# EAGLE design TSOC-USBUART1-3-2 (EAGLE 6.6.0)
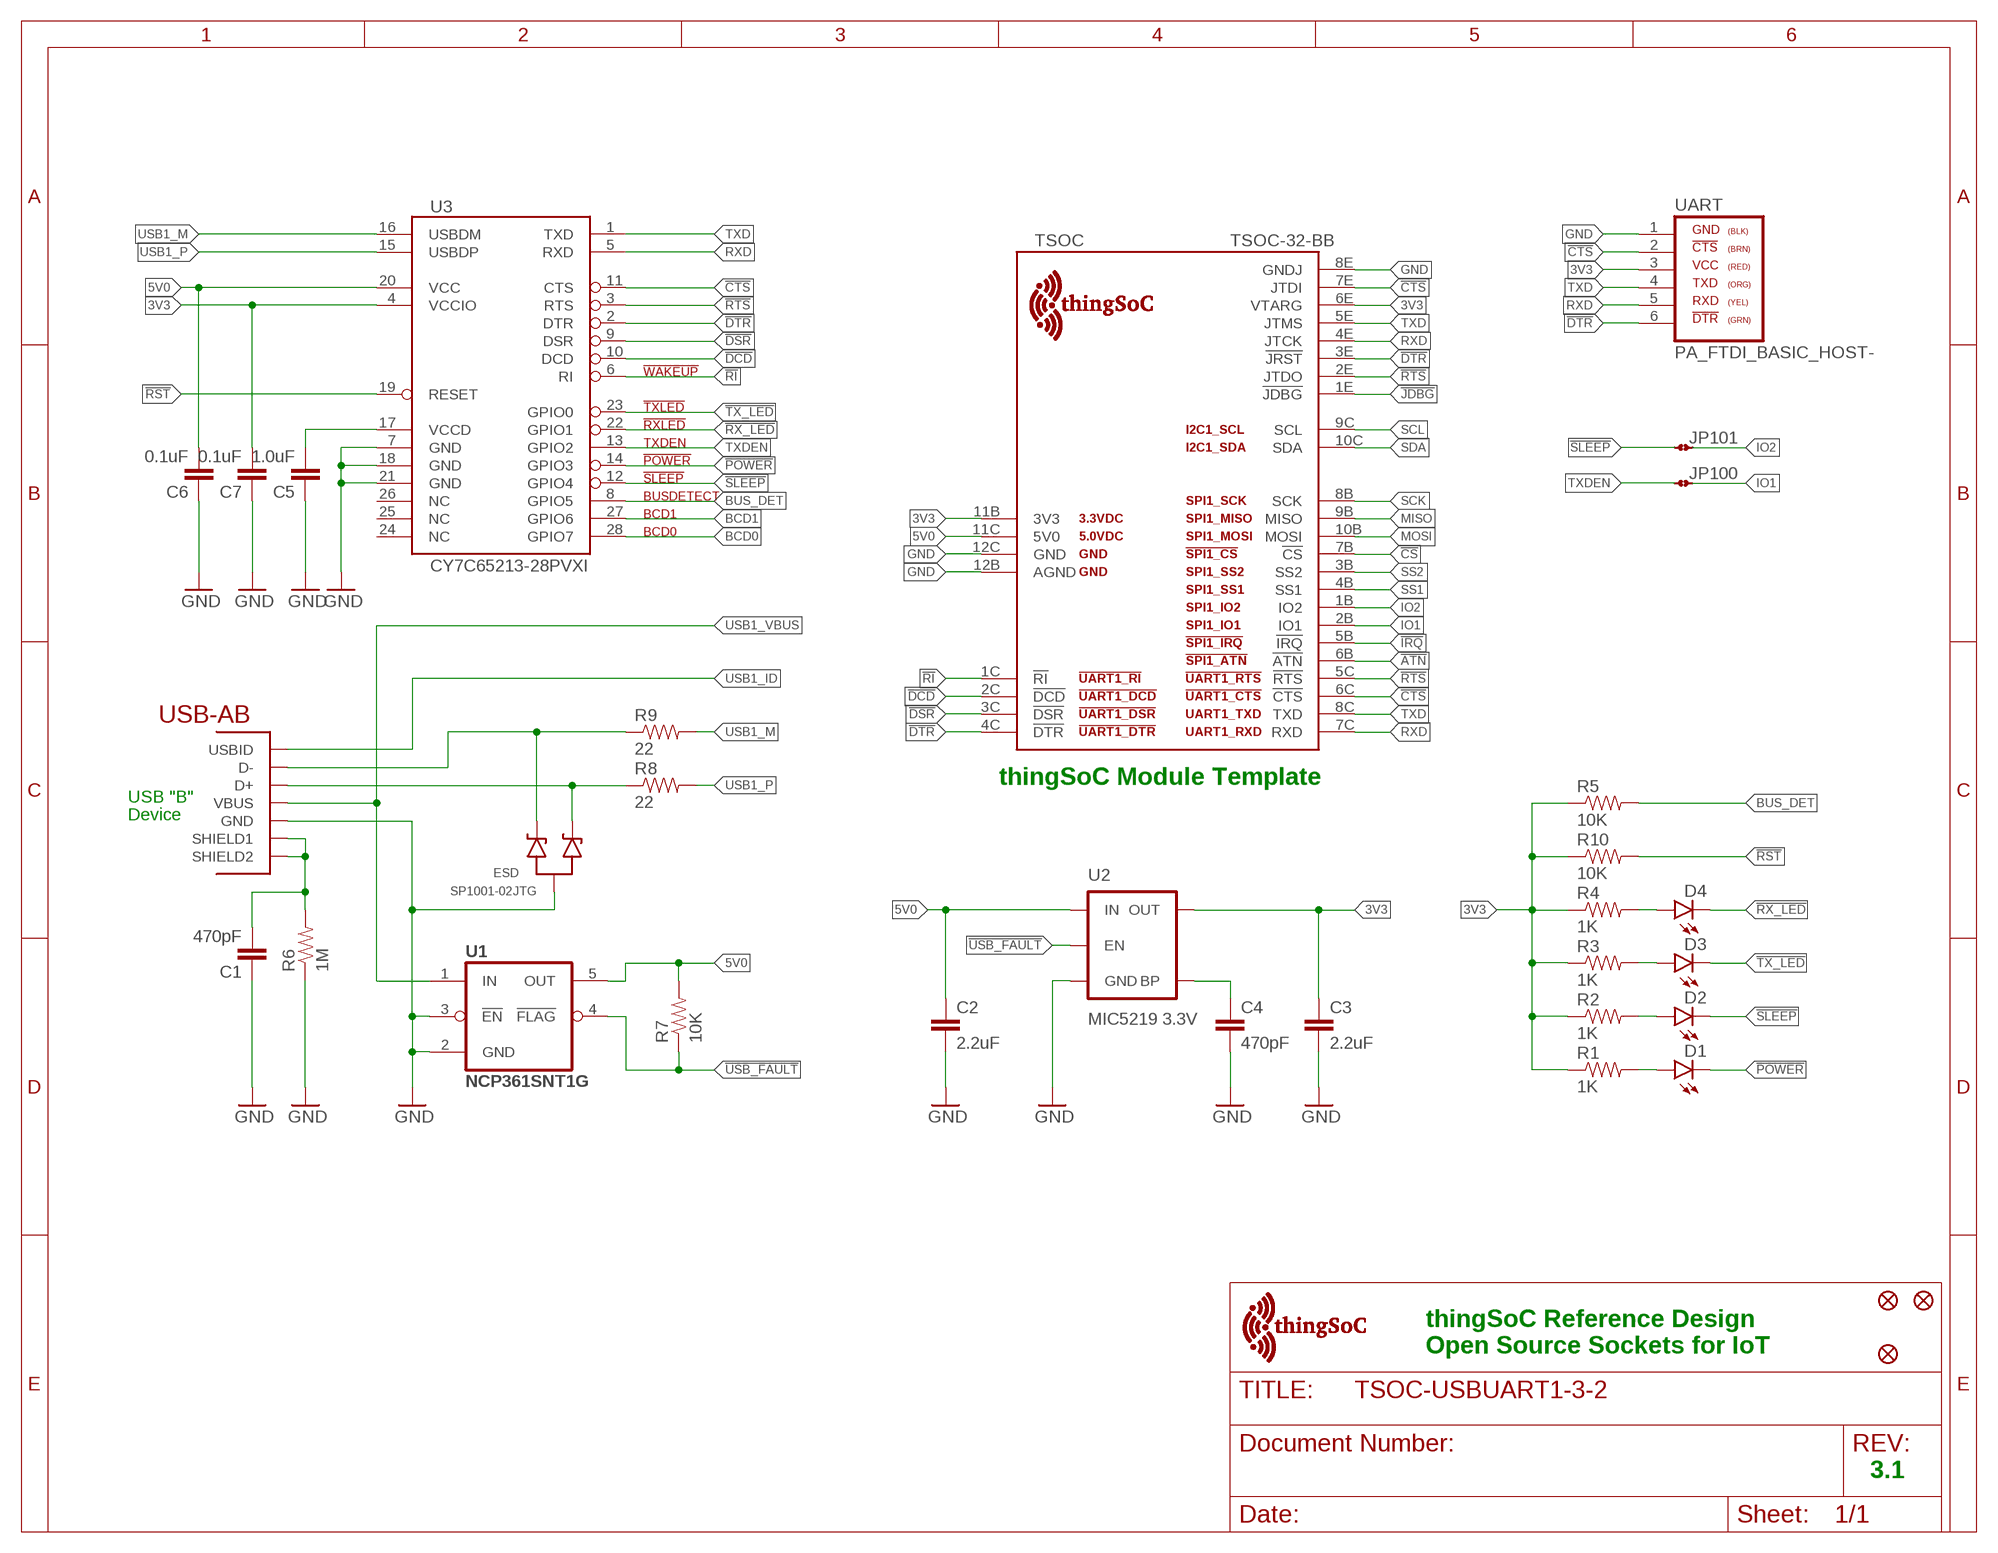
[diagram p0: schematic, sheet 1]

## Parts
C1  470pF  CAP0603-CAP  [0603-CAP]
C2  2.2uF  CAP0603-CAP  [0603-CAP]
C3  2.2uF  CAP0603-CAP  [0603-CAP]
C4  470pF  CAP0603-CAP  [0603-CAP]
C5  1.0uF  CAP0603-CAP  [0603-CAP]
C6  0.1uF  CAP0603-CAP  [0603-CAP]
C7  0.1uF  CAP0603-CAP  [0603-CAP]
D1  LED0603  [LED-0603]
D2  LED0603  [LED-0603]
D3  LED0603  [LED-0603]
D4  LED0603  [LED-0603]
ESD  SP1001-02JTG  [SC70-3]
FID1  FIDUCIAL1.5X3  [FIDUCIAL-1.5X3]
FID2  FIDUCIAL1.5X3  [FIDUCIAL-1.5X3]
FID3  FIDUCIAL1.5X3  [FIDUCIAL-1.5X3]
JP100  JMP-2-NO  [JMP-2-NO]
JP101  JMP-2-NO  [JMP-2-NO]
R1  1K  RESISTOR0603-RES  [0603-RES]
R2  1K  RESISTOR0603-RES  [0603-RES]
R3  1K  RESISTOR0603-RES  [0603-RES]
R4  1K  RESISTOR0603-RES  [0603-RES]
R5  10K  RESISTOR0603-RES  [0603-RES]
R6  1M  RESISTOR0603-RES  [0603-RES]
R7  10K  RESISTOR0603-RES  [0603-RES]
R8  22  RESISTOR0603-RES  [0603-RES]
R9  22  RESISTOR0603-RES  [0603-RES]
R10  10K  RESISTOR0603-RES  [0603-RES]
TSOC  TSOC-32-BB  [TSOC-BB-S32]
U1  NCP361SNT1G  [SOP95P275X110-5N]
U2  MIC5219 3.3V  V_REG_MIC52193.3V  [SOT23-5]
U3  CY7C65213-28PVXI  [SSOP28DB]
U$2  TSOC-LOGO-MED  [TSOC-LOGO-MED]
U$101  TSOC-LOGO-MED  [TSOC-LOGO-MED]
UART  PA_FTDI_BASIC_HOST-  [PA_FTDI_M5X1]
USB1  USB_AB  [USB-AB-MICRO-SMD]

## Nets
3V3: C3.1 C7.2 R1.1 R2.1 R3.1 R4.1 R5.1 R10.1 TSOC.6E(VTARG) TSOC.11B(3V3) U2.5(OUT) U3.4(VCCIO) UART.3
5V0: C2.1 C6.2 R7.2 TSOC.11C(5V0) U1.5(OUT) U2.1(IN) U3.20(VCC)
!ATN: TSOC.6B(!ATN)
!CS: TSOC.7B(!CS)
!CTS: TSOC.6C(!CTS) TSOC.7E(JTDI) U3.11(CTS) UART.2
!DCD: TSOC.2C(!DCD) U3.10(DCD)
!DSR: TSOC.3C(!DSR) U3.9(DSR)
!DTR: TSOC.3E(!JRST) TSOC.4C(!DTR) U3.2(DTR) UART.6
!IRQ: TSOC.5B(!IRQ)
!JDBG: TSOC.1E(!JDBG)
!POWER: D1.C U3.14(GPIO3)
!RI: TSOC.1C(!RI) U3.6(RI)
!RST: R10.2 U3.19(RESET)
!RTS: TSOC.2E(JTDO) TSOC.5C(!RTS) U3.3(RTS)
!RX_LED: D4.C U3.22(GPIO1)
!SLEEP: D2.C JP101.1 U3.12(GPIO4)
!TX_LED: D3.C U3.23(GPIO0)
!USB_FAULT: R7.1 U1.4(!FLAG) U2.3(EN)
BCD0: U3.28(GPIO7)
BCD1: U3.27(GPIO6)
BLUE: D3.A R3.2
BUS_DET: R5.2 U3.8(GPIO5)
BYPASS: C4.1 U2.4(BP)
GND [vcc]: C1.1 C2.2 C3.2 C4.2 C5.1 C6.1 C7.1 ESD.3(A) R6.1 TSOC.8E(GNDJ) TSOC.12B(AGND) TSOC.12C(GND) U1.2(GND) U1.3(!EN) U2.2(GND) U3.7(GND) U3.18(GND) U3.21(GND) UART.1 USB1.GND
GRN: D1.A R1.2
IO1: JP100.2 TSOC.2B(IO1)
IO2: JP101.2 TSOC.1B(IO2)
MISO: TSOC.9B(MISO)
MOSI: TSOC.10B(MOSI)
RED: D2.A R2.2
RXD: TSOC.4E(JTCK) TSOC.7C(RXD) U3.5(RXD) UART.5
SCK: TSOC.8B(SCK)
SCL: TSOC.9C(SCL)
SDA: TSOC.10C(SDA)
SS1: TSOC.4B(SS1)
SS2: TSOC.3B(SS2)
TXD: TSOC.5E(JTMS) TSOC.8C(TXD) U3.1(TXD) UART.4
TXDEN: JP100.1 U3.13(GPIO2)
USB1_DM: ESD.2(C2) R9.1 USB1.D-
USB1_DP: ESD.1(C1) R8.1 USB1.D+
USB1_ID: USB1.ID(USBID)
USB1_M: R9.2 U3.16(USBDM)
USB1_P: R8.2 U3.15(USBDP)
USB1_SHIELD: C1.2 R6.2 USB1.SHIELD1 USB1.SHIELD2
USB1_VBUS: U1.1(IN) USB1.VBUS
VCCD: C5.2 U3.17(VCCD)
YEL: D4.A R4.2
Unconnected: U3.24(NC) U3.25(NC) U3.26(NC)

## Notes on the sheet
- thingSoC Module Template
- USB "B"
- Device
- thingSoC Reference Design
  Open Source Sockets for IoT
- 3.1

## Library data of the parts
C1-C7 = PatternAgents-ProtoPads:CAP: Capacitor Standard 0603 ceramic capacitor, and 0.1" leaded capacitor.
D1-D4 = SparkFun-LED:LED: LEDs Standard schematic elements and footprints for 5mm, 3mm, 1206, and 0603 sized LEDs. 5mm - Spark Fun Electronics SKU : COM-00529 (and others)
ESD = TSOC-ESP8266-BASE:SP1001-02JTG: Littelfuse SP1001-02JTG TVS Diode Array 8pf 15kV Source: http://www.littelfuse.com/data/en/Product_Catalogs/Littelfuse_TVS_Diode_Array_SPA_Catalog.pdf patternshed.com: created 3/25/2012
FID1-FID3 = PatternAgents-Misc:FIDUCIAL: Fiducial Alignment Points Various fiducial points for machine vision alignment.
JP100 JP101 = PatternAgents-ProtoPads:JMP-2-NO: Two Terminal Jumper - Normally Open Positions 1 and 2 are normally NOT connected. PatternAgents ProtoPads Library Schematic and PCB layout libraries for design patterns by PatternAgents. For the CADSoft Eagle CAD program : http://www.cadsoftusa.com/download-eagle/ Source LBR : http://www.patternagents.com Github : https://github.com/PatternAgents License : http://creativecommons.org/licenses/by-sa/4.0/ (Creative Commons 4.0) THIS SOFTWARE IS PROVIDED BY THE CONTRIBUTORS "AS IS" AND WITHOUT ANY EXPRESS OR IMPLIED WARRANTIES, INCLUDING, BUT NOT LIMITED TO, THE IMPLIED WARRANTIES OF MERCHANTABILITY AND FITNESS FOR A PARTICULAR PURPOSE ARE DISCLAIMED. IN NO EVENT SHALL THE COPYRIGHT OWNER OR CONTRIBUTORS BE LIABLE FOR ANY DIRECT, INDIRECT, INCIDENTAL, SPECIAL, EXEMPLARY, OR CONSEQUENTIAL DAMAGES (INCLUDING, BUT NOT LIMITED TO, PROCUREMENT OF SUBSTITUTE GOODS OR SERVICES; LOSS OF USE, DATA, OR PROFITS; OR BUSINESS INTERRUPTION) HOWEVER CAUSED AND ON ANY THEORY OF LIABILITY, WHETHER IN CONTRACT, STRICT LIABILITY, OR TORT (INCLUDING NEGLIGENCE OR OTHERWISE) ARISING IN ANY WAY OUT OF THE USE OF THIS SOFTWARE, EVEN IF ADVISED OF THE POSSIBILITY OF SUCH DAMAGE.; BOM: EXCLUDE
R1-R10 = PatternAgents-ProtoPads:RESISTOR: Resistor Basic schematic elements and footprints for 0603, 1206, and PTH resistors.
TSOC = thingSoC:TSOC-32: thingSoC Thirty-Two (32) Pin Socket Source LBR : http://www.thingsoc.com Github : https://github.com/thingsoc License : http://creativecommons.org/licenses/by-sa/4.0/ (Creative Commons 4.0) THIS SOFTWARE IS PROVIDED BY THE CONTRIBUTORS "AS IS" AND WITHOUT ANY EXPRESS OR IMPLIED WARRANTIES, INCLUDING, BUT NOT LIMITED TO, THE IMPLIED WARRANTIES OF MERCHANTABILITY AND FITNESS FOR A PARTICULAR PURPOSE ARE DISCLAIMED. IN NO EVENT SHALL THE COPYRIGHT OWNER OR CONTRIBUTORS BE LIABLE FOR ANY DIRECT, INDIRECT, INCIDENTAL, SPECIAL, EXEMPLARY, OR CONSEQUENTIAL DAMAGES (INCLUDING, BUT NOT LIMITED TO, PROCUREMENT OF SUBSTITUTE GOODS OR SERVICES; LOSS OF USE, DATA, OR PROFITS; OR BUSINESS INTERRUPTION) HOWEVER CAUSED AND ON ANY THEORY OF LIABILITY, WHETHER IN CONTRACT, STRICT LIABILITY, OR TORT (INCLUDING NEGLIGENCE OR OTHERWISE) ARISING IN ANY WAY OUT OF THE USE OF THIS SOFTWARE, EVEN IF ADVISED OF THE POSSIBILITY OF SUCH DAMAGE.
U1 = PatternAgents-OnSemi:NCP361SNT1G: USB Positive Overvoltage Protection Controller; MPN: NCP361SNT1G; OC_FARNELL: 1642242; OC_NEWARK: 01P0135; PACKAGE: TSOP-5; SUPPLIER: ON Semiconductor
U2 = SparkFun-PowerIC:V_REG_MIC5219: V_REG MIC5219 Standard 3.3V and 5V 500mA LDO voltage regulator in SOT-23 layout. Micrel part MIC5219. BP (by-pass) pin is used to lower output noise with 470pF cap, may be left open.; PROD_ID: VREG-09872
U3 = PatternAgents-Cypress:CY7C65213-28: Cypress EZ-USB ® CY7C65213-28SSOP USB TO UART BRIDGE Full-Speed USB Peripheral Controller Source Data: http://www.cypress.com/?mpn=CY7C65213-28xxxx LBR Source: http://www.patternagents.com THIS SOFTWARE IS PROVIDED BY THE CONTRIBUTORS "AS IS" AND WITHOUT ANY EXPRESS OR IMPLIED WARRANTIES, INCLUDING, BUT NOT LIMITED TO, THE IMPLIED WARRANTIES OF MERCHANTABILITY AND FITNESS FOR A PARTICULAR PURPOSE ARE DISCLAIMED. IN NO EVENT SHALL THE COPYRIGHT OWNER OR CONTRIBUTORS BE LIABLE FOR ANY DIRECT, INDIRECT, INCIDENTAL, SPECIAL, EXEMPLARY, OR CONSEQUENTIAL DAMAGES (INCLUDING, BUT NOT LIMITED TO, PROCUREMENT OF SUBSTITUTE GOODS OR SERVICES; LOSS OF USE, DATA, OR PROFITS; OR BUSINESS INTERRUPTION) HOWEVER CAUSED AND ON ANY THEORY OF LIABILITY, WHETHER IN CONTRACT, STRICT LIABILITY, OR TORT (INCLUDING NEGLIGENCE OR OTHERWISE) ARISING IN ANY WAY OUT OF THE USE OF THIS SOFTWARE, EVEN IF ADVISED OF THE POSSIBILITY OF SUCH DAMAGE.
U$2 U$101 = thingSoC:TSOC-LOGO: thingSoC Logo Source LBR : http://www.thingsoc.com Github : https://github.com/thingsoc License : http://creativecommons.org/licenses/by-sa/4.0/ (Creative Commons 4.0) THIS SOFTWARE IS PROVIDED BY THE CONTRIBUTORS "AS IS" AND WITHOUT ANY EXPRESS OR IMPLIED WARRANTIES, INCLUDING, BUT NOT LIMITED TO, THE IMPLIED WARRANTIES OF MERCHANTABILITY AND FITNESS FOR A PARTICULAR PURPOSE ARE DISCLAIMED. IN NO EVENT SHALL THE COPYRIGHT OWNER OR CONTRIBUTORS BE LIABLE FOR ANY DIRECT, INDIRECT, INCIDENTAL, SPECIAL, EXEMPLARY, OR CONSEQUENTIAL DAMAGES (INCLUDING, BUT NOT LIMITED TO, PROCUREMENT OF SUBSTITUTE GOODS OR SERVICES; LOSS OF USE, DATA, OR PROFITS; OR BUSINESS INTERRUPTION) HOWEVER CAUSED AND ON ANY THEORY OF LIABILITY, WHETHER IN CONTRACT, STRICT LIABILITY, OR TORT (INCLUDING NEGLIGENCE OR OTHERWISE) ARISING IN ANY WAY OUT OF THE USE OF THIS SOFTWARE, EVEN IF ADVISED OF THE POSSIBILITY OF SUCH DAMAGE.
UART = PatternAgents-Interface:PA_FTDI_BASIC_HOST: PatternAgents FTDI UART BASIC Pattern Pinout for "BASIC" FTDI USB-UART adaptor from Sparkfun and others. Source LBR : http://www.patternagents.com Github : https://github.com/patternagents Source Data : http://www.sparkfun.com/datasheets/DevTools/Arduino/FTDI%20Basic-v21-5V.pdf PA Pattern License : http://creativecommons.org/licenses/by-sa/4.0/ (Creative Commons 4.0) THIS SOFTWARE IS PROVIDED BY THE CONTRIBUTORS "AS IS" AND WITHOUT ANY EXPRESS OR IMPLIED WARRANTIES, INCLUDING, BUT NOT LIMITED TO, THE IMPLIED WARRANTIES OF MERCHANTABILITY AND FITNESS FOR A PARTICULAR PURPOSE ARE DISCLAIMED. IN NO EVENT SHALL THE COPYRIGHT OWNER OR CONTRIBUTORS BE LIABLE FOR ANY DIRECT, INDIRECT, INCIDENTAL, SPECIAL, EXEMPLARY, OR CONSEQUENTIAL DAMAGES (INCLUDING, BUT NOT LIMITED TO, PROCUREMENT OF SUBSTITUTE GOODS OR SERVICES; LOSS OF USE, DATA, OR PROFITS; OR BUSINESS INTERRUPTION) HOWEVER CAUSED AND ON ANY THEORY OF LIABILITY, WHETHER IN CONTRACT, STRICT LIABILITY, OR TORT (INCLUDING NEGLIGENCE OR OTHERWISE) ARISING IN ANY WAY OUT OF THE USE OF THIS SOFTWARE, EVEN IF ADVISED OF THE POSSIBILITY OF SUCH DAMAGE.
USB1 = BeeSafe:USB_AB: This is a USB AB connector that is compatible with USB OTG. i.e. this connector can serve as a host or device

## Net classes
1 vcc: width 0.254 mm

## Board
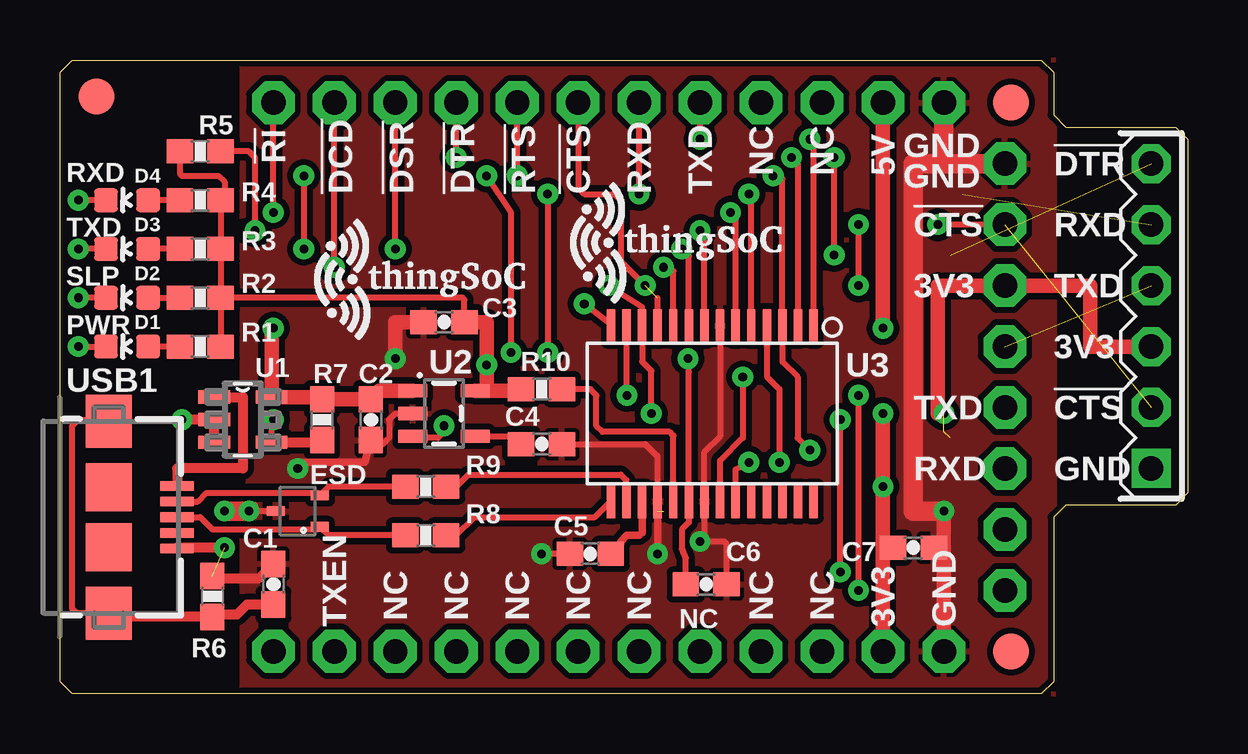
[diagram p1: board, top side]
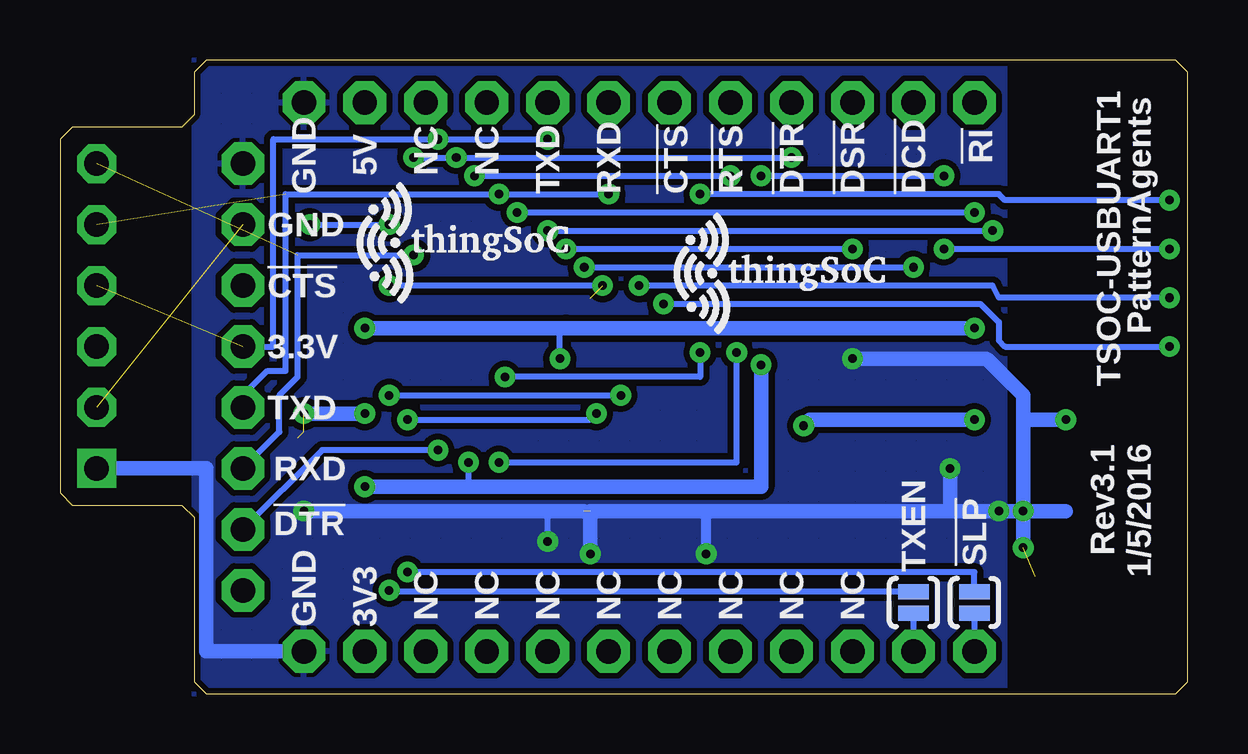
[diagram p2: board, bottom side, seen from below]

Size 46.99 x 26.42 mm. Coordinates in mm from the lower left corner, seen from the top.
Outline: 0.51,0 0,0.51 0,25.91 0.51,26.42 40.89,26.42 41.4,25.91 41.4,24.13 41.91,23.62 46.48,23.62 46.99,23.11 46.99,8.38 46.48,7.87 41.91,7.87 41.4,7.37 41.4,0.51 40.89,0 0.51,0
Copper layers (1*16): Top 0.035mm / dielectric 1.5mm / Bottom 0.035mm
Design rules "PatternAgents_7mil": minimum track width 7mil, minimum drill 14mil, track to track 7mil, track to pad 7mil, pad to pad 7mil, via to via 7mil, smd to smd 7mil, copper to edge 7mil, drill to drill 7mil, minimum pad ring 12mil, minimum via ring 10mil, stop-mask expansion 4mil, vias tented up to drill 25mil, thermal gap 7mil

### Footprints (pad centres in the part's own frame; a part is rotated, then mirrored left to right if it is on the bottom)
0603-CAP = smd 1.1 x 1: 1 -0.85,0; 2 0.85,0
LED-0603 = smd 1 x 1: A 0,-0.877; C 0,0.877
SC70-3 = smd 0.4 x 0.75: 1 -0.65,-0.925; 2 0.65,-0.925; 3 0,0.925
FIDUCIAL-1.5X3 = smd 1.5 x 1.5: 1 0,0
JMP-2-NO = smd 0.635 x 1.27: 1 -0.45,0; 2 0.45,0
0603-RES = smd 1.1 x 1: 1 -0.85,0; 2 0.85,0
TSOC-BB-S32 = drill 1.016 pad 1.778 octagon: 1B -11.43,-11.43; 1C -11.43,11.43; 1E 19.05,-8.89; 2B -8.89,-11.43; 2C -8.89,11.43; 2E 19.05,-6.35; 3B -6.35,-11.43; 3C -6.35,11.43; 3E 19.05,-3.81; 4B -3.81,-11.43; 4C -3.81,11.43; 4E 19.05,-1.27; 5B -1.27,-11.43; 5C -1.27,11.43; 5E 19.05,1.27; 6B 1.27,-11.43; 6C 1.27,11.43; 6E 19.05,3.81; 7B 3.81,-11.43; 7C 3.81,11.43; 7E 19.05,6.35; 8B 6.35,-11.43; 8C 6.35,11.43; 8E 19.05,8.89; 9B 8.89,-11.43; 9C 8.89,11.43; 10B 11.43,-11.43; 10C 11.43,11.43; 11B 13.97,-11.43; 11C 13.97,11.43; 12B 16.51,-11.43; 12C 16.51,11.43
SOP95P275X110-5N = smd 1.321 x 0.559: 1 -1.194,0.94; 2 -1.194,0; 3 -1.194,-0.94; 4 1.194,-0.94; 5 1.194,0.94
SOT23-5 = smd 0.55 x 1.2: 1 -0.95,-1.3; 2 0,-1.3; 3 0.95,-1.3; 4 0.95,1.3; 5 -0.95,1.3
SSOP28DB = smd 0.348 x 1.397: 1 -4.225,-3.656; 2 -3.575,-3.656; 3 -2.925,-3.656; 4 -2.275,-3.656; 5 -1.625,-3.656; 6 -0.975,-3.656; 7 -0.325,-3.656; 8 0.325,-3.656; 9 0.975,-3.656; 10 1.625,-3.656; 11 2.275,-3.656; 12 2.925,-3.656; 13 3.575,-3.656; 14 4.225,-3.656; 15 4.225,3.656; 16 3.575,3.656; 17 2.925,3.656; 18 2.275,3.656; 19 1.625,3.656; 20 0.975,3.656; 21 0.325,3.656; 22 -0.325,3.656; 23 -0.975,3.656; 24 -1.625,3.656; 25 -2.275,3.656; 26 -2.925,3.656; 27 -3.575,3.656; 28 -4.225,3.656
PA_FTDI_M5X1 = drill 1.016 square: 1 -1.27,6.35 | drill 1.016 octagon: 2 -1.27,3.81; 3 -1.27,1.27; 4 -1.27,-1.27; 5 -1.27,-3.81; 6 -1.27,-6.35
USB-AB-MICRO-SMD = smd 1.4 x 0.4: D+ 2.85,0; D- 2.85,0.65; GND 2.85,-1.3; ID 2.85,-0.65; VBUS 2.85,1.3 | smd 1.9 x 2: P$6 0,1.25; P$7 0,-1.25 | smd 1.9 x 2.2: SHIELD1 0,4; SHIELD2 0,-4

### Placement (x,y rotation side)
C1  8.89,4.57 270 top
C2  12.95,11.43 270 top
C3  16,15.49 180 top
C4  20.07,10.41 0 top
C5  22.1,5.84 0 top
C6  26.92,4.57 180 top
C7  35.56,6.1 180 top
D1  2.79,14.48 90 top
D2  2.79,16.51 90 top
D3  2.79,18.54 90 top
D4  2.79,20.57 90 top
ESD  9.91,7.62 90 top
FID1  1.52,24.89 0 top
FID2  39.62,1.78 0 top
FID3  39.62,24.64 0 top
JP100  11.43,3.81 270 bottom
JP101  8.89,3.81 270 bottom
R1  5.84,14.48 180 top
R2  5.84,16.51 180 top
R3  5.84,18.54 180 top
R4  5.84,20.57 180 top
R5  5.84,22.61 0 top
R6  6.35,4.06 270 top
R7  10.92,11.43 90 top
R8  15.24,6.6 0 top
R9  15.24,8.64 0 top
R10  20.07,12.7 0 top
TSOC  20.32,13.21 0 top
U1  7.62,11.43 0 top
U2  16,11.68 270 top
U3  27.18,11.68 180 top
U$1  TSOC-LOGO-MED  [TSOC-LOGO-MED]  12.19,17.27 0 top
U$2  22.86,18.8 0 top
U$101  33.02,18.8 0 bottom
U$102  TSOC-LOGO-MED  [TSOC-LOGO-MED]  19.81,17.53 0 bottom
UART  44.2,15.75 180 top
USB1  2.03,7.37 0 top

### Tracks (layer width: path | path; a pad name or v marks a point on that pad's centre or on a via)
3V3  (via drill 0.36)  (2 unrouted)
  Top 0.254: 29.96,9.66 v29.97,9.65 29.97,12.7 29.45,13.22 U3.4 | R5.1 4.99,21.68 5.08,21.59 6.6,21.59 6.86,21.34 6.86,20.74 R4.1 R3.1 R2.1 | R2.1 R1.1 | C3.1 16.85,16.42 16.76,16.51 R2.1
  Top 0.61: R10.1 19.15,12.63 U2.5 17.71,12.63 17.78,12.7 v17.78,13.72 17.78,15.49 C3.1 | TSOC.11B 34.29,6.18 | 34.29,6.18 C7.2 | 34.29,6.18 v34.29,8.64 v34.29,11.68 | v36.83,11.68 36.58,11.68 36.58,17.02 TSOC.6E 42.93,17.02 42.93,14.48 UART.3
  Bottom 0.254: v29.97,9.65 29.97,8.64
  Bottom 0.61: v17.78,13.72 17.78,8.64 29.97,8.64 v34.29,8.64 | v34.29,11.68 v36.83,11.68
5V0  (via drill 0.36)
  Top 0.254: v26.16,13.97 26.2,13.42 U3.20 26.2,7.15 25.91,6.86 25.91,6.1 26.07,5.68 C6.2
  Top 0.61: U2.1 13.31,12.63 C2.1 R7.2 10.83,12.37 U1.5 8.81,15.16 v8.89,15.24 | TSOC.11C v34.29,15.24
  Bottom 0.254: v26.16,13.97 26.16,14.99 25.91,15.24
  Bottom 0.61: v34.29,15.24 25.91,15.24 v8.89,15.24
!CTS  (via drill 0.36)  (2 unrouted)
  Top 0.254: TSOC.6C 21.59,21.08 21.84,20.83 23.11,20.83 23.37,20.57 23.37,18.03 v24.38,17.02 | U3.11 24.9,16.5 | v33.27,17.02 v33.27,19.56 | TSOC.7E v36.58,19.56
  Bottom 0.254: v24.38,17.02 v33.27,17.02 | v36.58,19.56 v33.27,19.56
!DCD  (via drill 0.36)
  Top 0.254: U3.10 25.55,17.63 v25.15,17.78 | v11.43,17.78 TSOC.2C
  Bottom 0.254: v25.15,17.78 v11.43,17.78
!DSR  (via drill 0.36)
  Top 0.254: U3.9 26.2,18.25 v25.91,18.54 | v13.97,18.54 TSOC.3C
  Bottom 0.254: v25.91,18.54 v13.97,18.54
!DTR  (via drill 0.36)  (1 unrouted)
  Top 0.254: U3.2 30.75,22.08 v30.48,22.35 | v16.51,22.35 TSOC.4C | v32.26,18.29 v32.26,22.35
  Bottom 0.254: v16.51,22.35 v30.48,22.35 v32.26,22.35 | TSOC.3E 37.85,10.92 37.85,12.45 37.08,13.21 37.08,18.29 v32.26,18.29
!POWER  (via drill 0.36)
  Top 0.254: U3.14 22.95,15.4 v21.84,16.26 | v0.76,14.48 D1.C
  Bottom 0.254: v21.84,16.26 8.64,16.26 7.87,15.49 7.87,14.73 7.62,14.48 v0.76,14.48
!RI  (via drill 0.36)
  Top 0.254: U3.6 28.15,19.85 v27.94,20.07 | v8.89,20.07 TSOC.1C
  Bottom 0.254: v27.94,20.07 v8.89,20.07
!RST
  Top 0.254: U3.19 25.55,10.77 25.4,10.92 22.61,10.92 22.35,11.18 22.35,12.45 22.1,12.7 R10.2
!RTS  (via drill 0.36)
  Top 0.254: v29.72,21.59 30.1,21.46 U3.3 30.1,13.84 30.73,13.21 30.73,10.67 v31.24,10.16 | v19.05,21.59 TSOC.5C
  Bottom 0.254: v29.72,21.59 v19.05,21.59 | v31.24,10.16 36.07,10.16 TSOC.2E
!RX_LED  (via drill 0.36)
  Top 0.254: D4.C v0.76,20.57 | v20.32,20.83 v20.32,14.22 | v28.45,13.21 28.45,10.67 27.5,9.72 U3.22
  Bottom 0.254: v0.76,20.57 7.62,20.57 7.87,20.83 v20.32,20.83 | v20.32,14.22 20.32,13.21 v28.45,13.21
!SLEEP  (via drill 0.36)
  Top 0.254: D2.C v0.76,16.51 | v22.86,17.02 24.25,16.13 U3.12 24.25,13.85 24.64,13.46 v24.64,11.68 | v32.51,5.08 v32.51,11.43
  Bottom 0.254: v0.76,16.51 7.87,16.51 8.13,17.02 v22.86,17.02 | JP101.1 8.89,5.08 v32.51,5.08 | v32.51,11.43 24.89,11.43 v24.64,11.68
!TX_LED  (via drill 0.36)
  Top 0.254: D3.C v0.76,18.54 | U3.23 28.15,9.36 v28.7,9.65 | v18.8,14.22 18.8,20.07 v17.78,21.59 | v10.16,21.59 v10.16,18.54
  Bottom 0.254: v28.7,9.65 18.8,9.65 v18.8,14.22 | v17.78,21.59 v10.16,21.59 | v10.16,18.54 v0.76,18.54
!USB_FAULT  (via drill 0.36)
  Top 0.254: U1.4 8.81,11.35 v8.89,11.43 | v16,11.18 16,10.92 15.75,10.67 14.77,10.67 U2.3
  Top 0.406: U1.4 10.67,10.49 R7.1
  Bottom 0.254: 15.75,11.43 v16,11.18
  Bottom 0.61: v8.89,11.43 15.75,11.43
BLUE
  Top 0.254: R3.2 D3.A
BUS_DET  (via drill 0.36)
  Top 0.254: U3.8 26.85,19.12 v26.67,19.3 | v8.13,19.3 8.13,22.35 7.87,22.61 R5.2
  Bottom 0.254: v26.67,19.3 v8.13,19.3
BYPASS
  Top 0.254: U2.4 18.9,10.73 C4.1
GND  (via drill 0.36)  (2 unrouted)
  Top 0.254: 4.88,6.1 USB1.GND | C5.1 v20.07,5.84 | U2.2 13.97,11.68 13.72,11.43 13.72,10.67 13.46,10.41 13.12,10.41 C2.2 | C4.2 24.38,10.41 24.89,9.91 U3.18 | U3.7 27.5,10.74 26.85,10.09 U3.21 26.85,6.53 v26.67,6.35 27.69,6.35 27.77,6.26 C6.1 | ESD.3 v7.87,7.62 | 8.13,7.87 v7.87,7.62 | 7.87,7.37 v7.87,7.62
  Top 0.305: U3.18 24.9,6.36 v24.89,5.84 | v9.91,9.4 10.16,9.65 12.7,9.65 C2.2
  Top 0.406: v6.86,6.1 4.88,6.1 | v5.08,11.43 U1.2 U1.3 | R6.1 6.35,4.83 8.29,4.83 C1.1
  Top 0.61: TSOC.12B 36.83,6.1 | 36.83,6.1 v36.83,7.62 | C7.1 36.83,6.1 | C3.2 13.97,15.49 v13.97,13.97
  Top 0.813: v7.87,7.62 v6.86,7.62 | TSOC.12C 36.83,22.1 | 36.83,22.1 35.56,22.1 35.56,7.62 v36.83,7.62 | TSOC.8E 36.83,22.1
  Bottom 0.254: v26.67,6.35 26.67,7.37 26.42,7.62
  Bottom 0.406: v20.07,5.84 20.07,7.62
  Bottom 0.61: v6.86,7.62 v6.86,6.1 | v9.91,9.4 9.91,7.62 | 5.08,7.62 v6.86,7.62 | 9.91,7.62 20.07,7.62 24.89,7.62 v24.89,5.84 | v6.86,7.62 v7.87,7.62 9.91,7.62 | v36.83,7.62 26.42,7.62 25.16,7.62 | v5.08,11.43 6.6,11.43 arc-90 6.86,11.18 | 6.86,11.18 v6.86,7.62 | v13.97,13.97 8.49,13.97 arc45 8.31,13.9 6.86,12.45 6.86,11.18 | TSOC.12B 40.89,1.78 40.89,9.4 UART.1
  pour Top (isolate 0.254, hatched): 7.62,0 7.62,26.42 41.4,26.42 41.4,0
  pour Bottom (isolate 0.254, hatched): 7.62,0 7.62,26.42 41.4,26.42 41.4,0
GRN
  Top 0.254: R1.2 D1.A
IO1
  Bottom 0.254: JP100.2 TSOC.2B
IO2
  Bottom 0.254: JP101.2 TSOC.1B
RED
  Top 0.254: D2.A R2.2
RXD  (via drill 0.36)  (1 unrouted)
  Top 0.254: U3.5 28.8,20.73 v28.7,20.83 | v24.13,20.83 TSOC.7C
  Bottom 0.254: v24.13,20.83 v28.7,20.83 37.59,20.83 37.59,13.46 38.35,13.46 39.37,12.45 TSOC.4E
TXD  (via drill 0.36)  (1 unrouted)
  Top 0.254: U3.1 31.4,22.95 v31.24,23.11 | v26.67,23.11 TSOC.8C
  Bottom 0.254: v26.67,23.11 v31.24,23.11 38.1,23.11 38.1,14.48 TSOC.5E
TXDEN  (via drill 0.36)
  Top 0.254: v33.27,4.32 v33.27,12.45 | v23.62,12.45 23.62,15.32 U3.13
  Bottom 0.254: JP100.1 33.22,4.26 v33.27,4.32 | v33.27,12.45 v23.62,12.45
USB1_DM
  Top 0.254: USB1.D- 5.73,8.02 6.1,8.38 10.72,8.38 ESD.2 11.2,8.64 R9.1
USB1_DP
  Top 0.254: USB1.D+ 5.84,7.37 6.35,6.86 10.72,6.86 ESD.1 11.2,6.6 R8.1
USB1_M
  Top 0.254: R9.2 16.51,8.64 17.02,9.14 23.37,9.14 23.6,8.91 U3.16
USB1_P
  Top 0.254: R8.2 16.51,6.6 17.27,7.37 22.29,7.37 U3.15
USB1_SHIELD
  Top 0.254: USB1.SHIELD2 1.52,3.37 0.7,3.37 0.51,3.56 0.51,11.18 0.76,11.43 1.97,11.43 USB1.SHIELD1
  Top 0.406: 1.84,3.05 1.52,3.37 | 2.03,2.46 USB1.SHIELD2 2.18,3.21 R6.2 6.44,3.3 7.37,3.3 7.79,3.72 C1.2
USB1_VBUS
  Top 0.406: USB1.VBUS 4.88,9.4 7.62,9.4 7.62,12.37 U1.1
VCCD
  Top 0.305: U3.17 24.25,6.73 24.13,6.6 23.62,6.6 23.37,6.35 23.37,6.26 C5.2
YEL
  Top 0.254: R4.2 D4.A

### Text on the board
tPlace: GND | !RI | NC | NC | 5V | GND | !DTR | RXD | !DCD | !DSR | !DTR | !RTS | !CTS | RXD | TXD | TXD | !CTS | RXD | SLP | 3V3 | TXD | PWR | 3V3 | TXD | !CTS | RXD | GND | NC | TXEN | NC | NC | NC | NC | NC | NC | NC | 3V3 | GND
bPlace: PatternAgents | TSOC-USBUART1 | !RI | NC | NC | 5V | !DCD | !DSR | !DTR | !RTS | !CTS | RXD | TXD | GND | GND | !CTS | 3.3V | TXD | 1/5/2016 | Rev3.1 | RXD | !DTR | !SLP | TXEN | NC | NC | NC | NC | NC | NC | NC | NC | 3V3 | GND